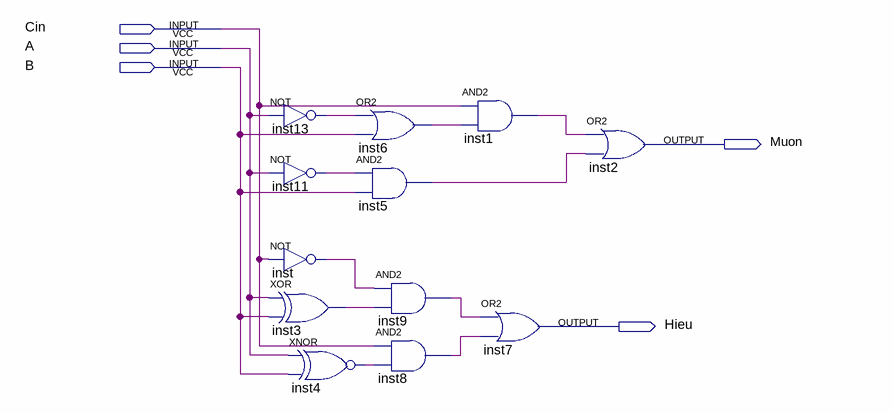
[diagram p0: schematic sheet]
// Quartus schematic Full_Subtractor.bdf as structural Verilog: 12 symbols, 5 pins
module Full_Subtractor (
  input  Cin,
  input  A,
  input  B,
  output Muon,
  output Hieu
);

  wire inst1_out, inst3_out, inst4_out, inst5_out, inst6_out, inst8_out, inst9_out, inst11_out, inst13_out,
       inst_out;

  not inst13 (inst13_out, A);
  not inst11 (inst11_out, A);
  not inst (inst_out, Cin);
  xor inst3 (inst3_out, A, B);
  xnor inst4 (inst4_out, A, B);
  or inst6 (inst6_out, inst13_out, B);
  and inst5 (inst5_out, inst11_out, B);
  and inst9 (inst9_out, inst_out, inst3_out);
  and inst8 (inst8_out, Cin, inst4_out);
  and inst1 (inst1_out, Cin, inst6_out);
  or inst7 (Hieu, inst9_out, inst8_out);
  or inst2 (Muon, inst1_out, inst5_out);
endmodule
